# EAGLE design BatterySplitSupply (EAGLE 9.6.0)
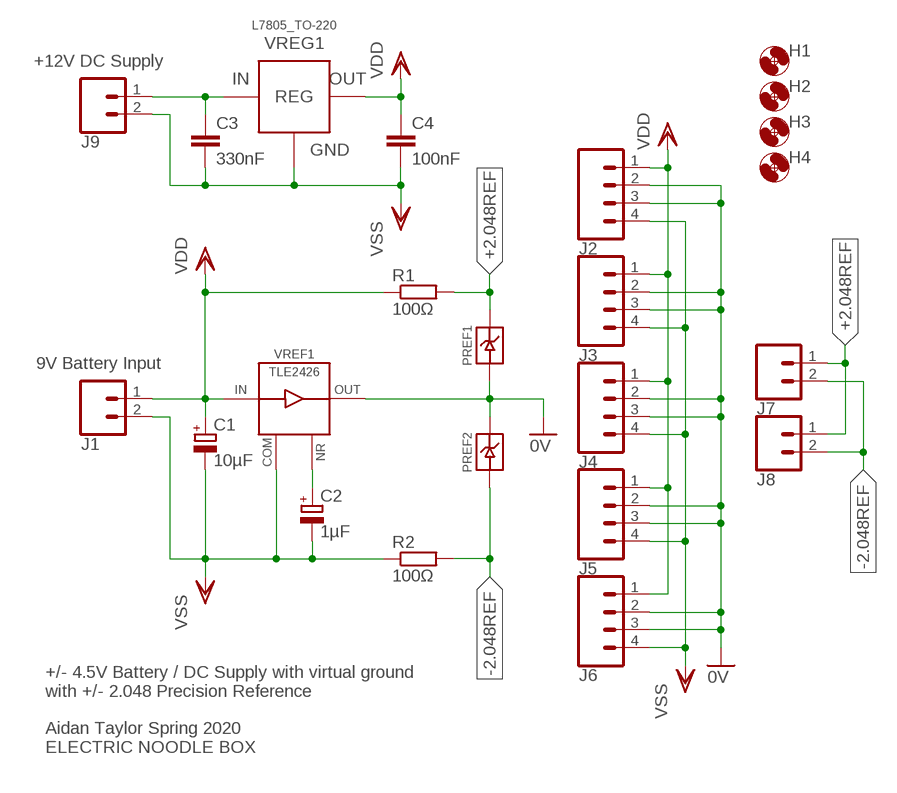
[diagram p0: schematic, sheet 1]

## Parts
C1  10µF  CPOL-EUE2-5  [E2-5]
C2  1µF  CPOL-EUE2-5  [E2-5]
C3  330nF  C-EU050-025X075  [C050-025X075]
C4  100nF  C-EU050-025X075  [C050-025X075]
H1  MOUNT-HOLE3.2  [3,2]
H2  MOUNT-HOLE3.2  [3,2]
H3  MOUNT-HOLE3.2  [3,2]
H4  MOUNT-HOLE3.2  [3,2]
J1  2XMOLEX  [MOLEX-1X2]
J2  4XMOLEX  [MOLEX-1X4]
J3  4XMOLEX  [MOLEX-1X4]
J4  4XMOLEX  [MOLEX-1X4]
J5  4XMOLEX  [MOLEX-1X4]
J6  4XMOLEX  [MOLEX-1X4]
J7  2XMOLEX  [MOLEX-1X2]
J8  2XMOLEX  [MOLEX-1X2]
J9  2XMOLEX  [MOLEX-1X2]
PREF1  LM4040TH  [TO-92]
PREF2  LM4040TH  [TO-92]
R1  100Ω  R-EU_0207/10  [0207/10]
R2  100Ω  R-EU_0207/10  [0207/10]
VREF1  TLE2426DIL  [DIL08]
VREG1  L7805_TO-220  [TO220H]

## Nets
0V: J2.2 J2.3 J3.2 J3.3 J4.2 J4.3 J5.2 J5.3 J6.2 J6.3 PREF1.3(ANODE) PREF2.2(CATHODE) VREF1.1(OUTPUT)
+2.048REF: J7.1 J8.1 PREF1.2(CATHODE) R1.2
-2.048REF: J7.2 J8.2 PREF2.3(ANODE) R2.2
GND: C3.2 C4.2 J9.2 VREG1.2(GND) ; supply symbol labelled VSS
N$1: C3.1 J9.1 VREG1.1(VIN)
N$6: C2.+ VREF1.8(NR)
VDD: C1.+ C4.1 J1.1 J2.1 J3.1 J4.1 J5.1 J6.1 R1.1 VREF1.3(INPUT) VREG1.3(VOUT)
VSS: C1.- C2.- J1.2 J2.4 J3.4 J4.4 J5.4 J6.4 R2.1 VREF1.2(COM)

## Notes on the sheet
- +12V DC Supply
- 9V Battery Input
- +/- 4.5V Battery / DC Supply with virtual ground
  with +/- 2.048 Precision Reference
  
  Aidan Taylor Spring 2020
  ELECTRIC NOODLE BOX

## Library data of the parts
C1 C2 = rcl:CPOL-EU: POLARIZED CAPACITOR, European symbol; SPICEPREFIX: C
C3 C4 = rcl:C-EU: CAPACITOR, European symbol; SPICEPREFIX: C
H1-H4 = holes:MOUNT-HOLE: MOUNTING HOLE with drill center marker
J1 J7-J9 = ElectricNoodleBox:2XMOLEX
J2-J6 = ElectricNoodleBox:4XMOLEX
PREF1 PREF2 = ElectricNoodleBox:LM4040
R1 R2 = rcl:R-EU_: RESISTOR, European symbol; SPICEPREFIX: R
VREF1 = ElectricNoodleBox:TLE2426
VREG1 = ElectricNoodleBox:L7805_TO-220

## Board
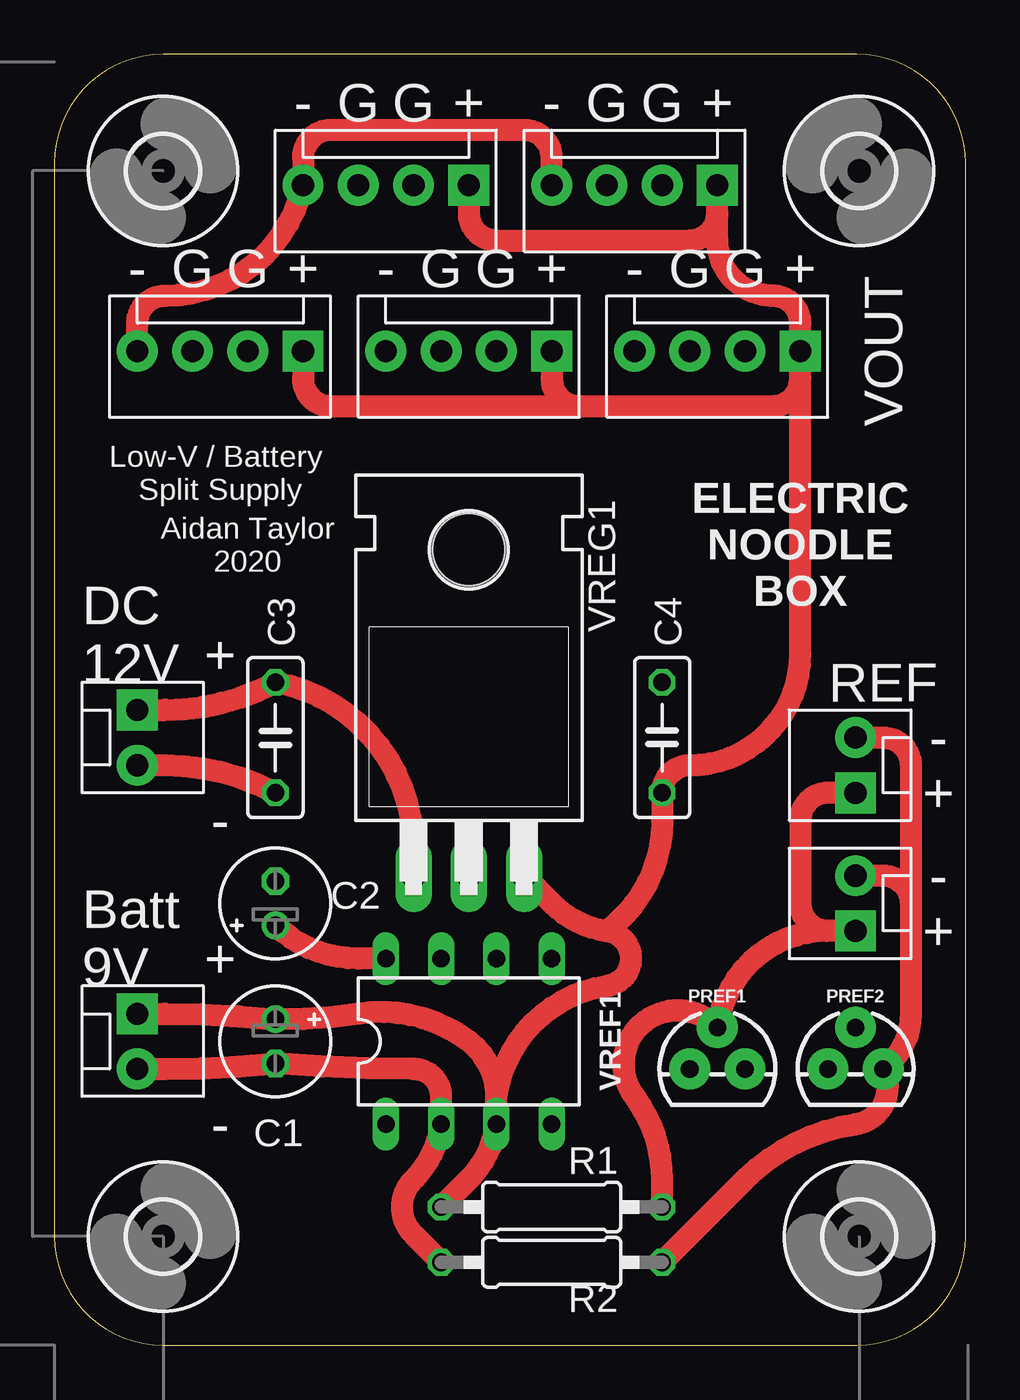
[diagram p1: board, top side]
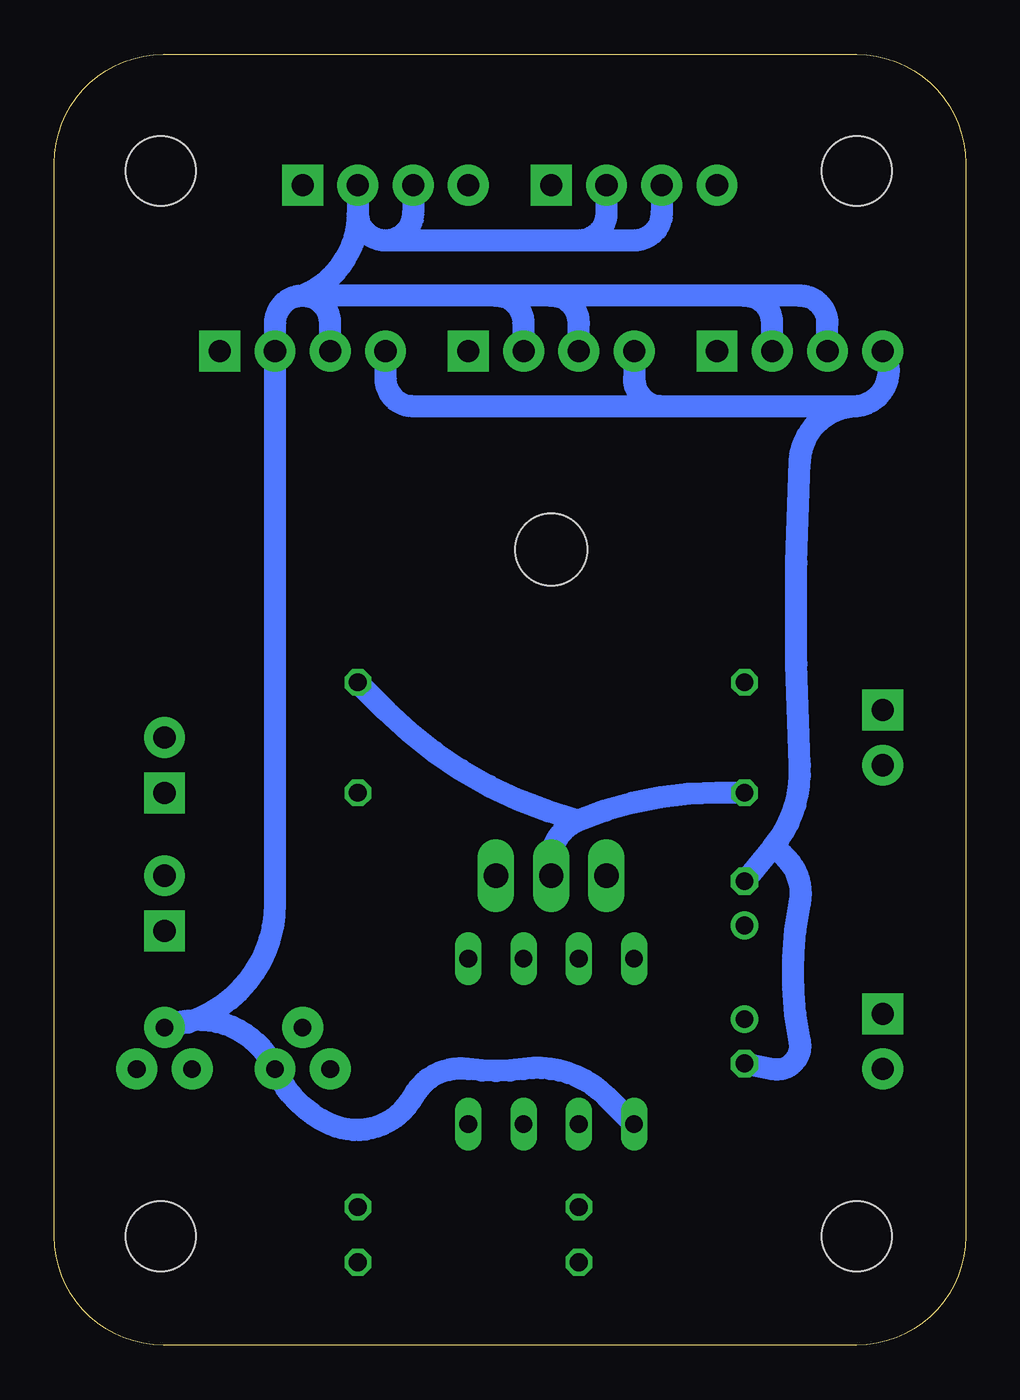
[diagram p2: board, bottom side, seen from below]

Size 41.89 x 59.36 mm. Coordinates in mm from the lower left corner, seen from the top.
Outline: 0,54.36 0,5 arc90 5,0 36.89,0 arc90 41.89,5 41.89,54.36 arc90 36.89,59.36 5,59.36 arc90 0,54.36
Copper layers (1*16): Top 0.035mm / dielectric 1.6mm / Bottom 0.035mm
Design rules "Elecrow_2-layer_PCB_eagle_rule": minimum track width 6mil, minimum drill 12mil, track to track 6mil, track to pad 6mil, pad to pad 6mil, via to via 8mil, smd to smd 0mil, copper to edge 20mil, drill to drill 10mil, minimum pad ring 6mil, minimum via ring 6mil, stop-mask expansion 0mil, vias tented up to drill 100mil, thermal gap 10mil

### Footprints (pad centres in the part's own frame; a part is rotated, then mirrored left to right if it is on the bottom)
E2-5 = drill 0.813 pad 1.27: + -1.016,0 | drill 0.813 pad 1.27 octagon: - 1.016,0
C050-025X075 = drill 0.813 octagon: 1 -2.54,0; 2 2.54,0
3,2 = hole 3.2: 0,0
MOLEX-1X2 = drill 1.016 pad 1.88 square: 1 0,0 | drill 1.016 pad 1.88: 2 2.54,0
MOLEX-1X4 = drill 1.016 pad 1.88 square: 1 0,0 | drill 1.016 pad 1.88: 2 2.54,0; 3 5.08,0; 4 7.62,0
TO-92 = drill 0.813 pad 1.88: 1 -1.27,0; 2 0,1.905; 3 1.27,0
0207/10 = drill 0.813 octagon: 1 -5.08,0; 2 5.08,0
DIL08 = drill 0.813 long: 1 -3.81,-3.81; 2 -1.27,-3.81; 3 1.27,-3.81; 4 3.81,-3.81; 5 3.81,3.81; 6 1.27,3.81; 7 -1.27,3.81; 8 -3.81,3.81
TO220H = drill 1.118 long: 1 -2.54,-10.16; 2 0,-10.16; 3 2.54,-10.16 | hole 3.302: 0,4.826

### Placement (x,y rotation side)
C1  10.16,13.97 270 top
C2  10.16,20.32 90 top
C3  10.16,27.94 270 top
C4  27.94,27.94 90 top
H1  5,5 0 top
H2  37,5 0 top
H3  37,54 90 top
H4  5,54 0 top
J1  3.81,15.24 270 top
J2  34.29,45.72 180 top
J3  22.86,45.72 180 top
J4  11.43,45.72 180 top
J5  19.05,53.34 180 top
J6  30.48,53.34 180 top
J7  36.83,19.05 90 top
J8  36.83,25.4 90 top
J9  3.81,29.21 270 top
PREF1  30.48,12.7 0 top
PREF2  36.83,12.7 0 top
R1  22.86,6.35 0 top
R2  22.86,3.81 0 top
VREF1  19.05,13.97 0 top
VREG1  19.05,31.75 0 top

### Tracks (layer width: path | path; a pad name or v marks a point on that pad's centre or on a via)
0V
  Bottom 1.016: VREF1.1 16.51,11.43 arc-53 20.32,12.7 arc16 22.86,12.7 arc-69 25.4,11.43 arc86 29.21,10.16 arc41 PREF1.3 arc-90 PREF2.2 arc-83 31.75,20.32 J2.2 31.75,46.99 arc90 30.48,48.26 | J4.3 6.35,46.99 arc-90 7.62,48.26 10.16,48.26 | 10.16,48.26 19.05,48.26 | 19.05,48.26 21.59,48.26 | 21.59,48.26 30.48,48.26 | J4.2 8.89,46.99 arc-90 10.16,48.26 | J3.3 17.78,46.99 arc-90 19.05,48.26 | J3.2 20.32,46.99 arc-90 21.59,48.26 | J2.3 29.21,46.99 arc-90 30.48,48.26 | J6.2 27.94,52.07 | 27.94,52.07 arc67 30.48,48.26 | J5.3 13.97,52.07 arc90 15.24,50.8 17.78,50.8 | 17.78,50.8 26.67,50.8 | 26.67,50.8 arc90 27.94,52.07 | J6.3 25.4,52.07 arc90 26.67,50.8 | J5.2 16.51,52.07 arc90 17.78,50.8
+2.048REF
  Top 1.016: R1.2 27.94,7.62 arc37 26.67,11.43 arc-174 PREF1.2 arc-82 35.56,19.05 | J7.1 35.56,19.05 | J8.1 35.56,25.4 arc90 34.29,24.13 34.29,20.32 arc90 35.56,19.05
-2.048REF
  Top 1.016: R2.2 31.75,7.62 arc-37 36.83,10.16 arc111 PREF2.3 arc53 39.37,15.24 39.37,20.32 | J7.2 38.1,21.59 arc-90 39.37,20.32 | J8.2 38.1,27.94 arc-90 39.37,26.67 39.37,20.32
GND
  Top 1.016: J9.2 5.08,26.67 arc-28 C3.2
  Bottom 1.016: C3.2 11.43,25.4 arc-23 17.78,24.13 | 17.78,24.13 arc-82 VREG1.2 | C4.2 26.67,29.21 arc-31 17.78,24.13
N$1
  Top 1.016: J9.1 5.08,29.21 arc28 C3.1 arc-80 16.51,22.86 VREG1.1
N$6
  Top 1.016: VREF1.8 13.97,17.78 arc-44 C2.+
VDD
  Top 1.016: J1.1 5.08,15.24 arc-6 C1.+ arc10 13.97,15.24 arc-46 19.05,13.97 arc-53 20.32,11.43 | 20.32,11.43 VREF1.3 arc-37 19.05,7.62 R1.1 | VREG1.3 22.86,20.32 arc37 25.4,19.05 | 25.4,19.05 arc-164 25.4,16.51 arc74 20.32,11.43 | 25.4,19.05 arc53 27.94,24.13 C4.1 arc-90 29.21,26.67 arc90 34.29,31.75 34.29,44.45 | 34.29,44.45 J2.1 34.29,46.99 arc90 33.02,48.26 arc-90 30.48,50.8 30.48,52.07 | J3.1 22.86,44.45 arc90 24.13,43.18 | 24.13,43.18 33.02,43.18 arc90 34.29,44.45 | J4.1 11.43,44.45 arc90 12.7,43.18 24.13,43.18 | 30.48,52.07 J6.1 | J5.1 19.05,52.07 arc90 20.32,50.8 29.21,50.8 arc90 30.48,52.07
VSS
  Top 1.016: J1.2 5.08,12.7 arc6 C1.- arc5 16.51,12.7 arc-90 17.78,11.43 VREF1.2 arc-37 16.51,7.62 arc90 16.51,5.08 R2.1 | J4.4 3.81,46.99 arc-90 5.08,48.26 arc77 J5.4 11.43,54.61 arc-90 12.7,55.88 21.59,55.88 arc-90 22.86,54.61 J6.4
  Bottom 1.016: C2.- 8.89,22.86 | 8.89,22.86 arc-43 7.62,26.67 arc6 7.62,40.64 arc84 5.08,43.18 | 5.08,43.18 arc-121 J4.4 | C1.- 8.89,12.7 arc-113 7.62,13.97 arc23 7.62,20.32 arc-76 8.89,22.86 | J3.4 15.24,44.45 arc-90 13.97,43.18 | 13.97,43.18 5.08,43.18 | J2.4 26.67,44.45 arc-90 25.4,43.18 13.97,43.18

### Text on the board
tPlace: - | G | G | + | - | G | G | + | - | G | G | + | - | G | G | + | - | G | G | + | VOUT | Low-V / Battery / Split Supply | Aidan Taylor / 2020 | ELECTRIC / NOODLE / BOX | + | DC / 12V | REF | - | + | - | - | + | + | Batt / 9V | -